# Altium schematic sheet WirelessReceiver.SchDoc
size A2
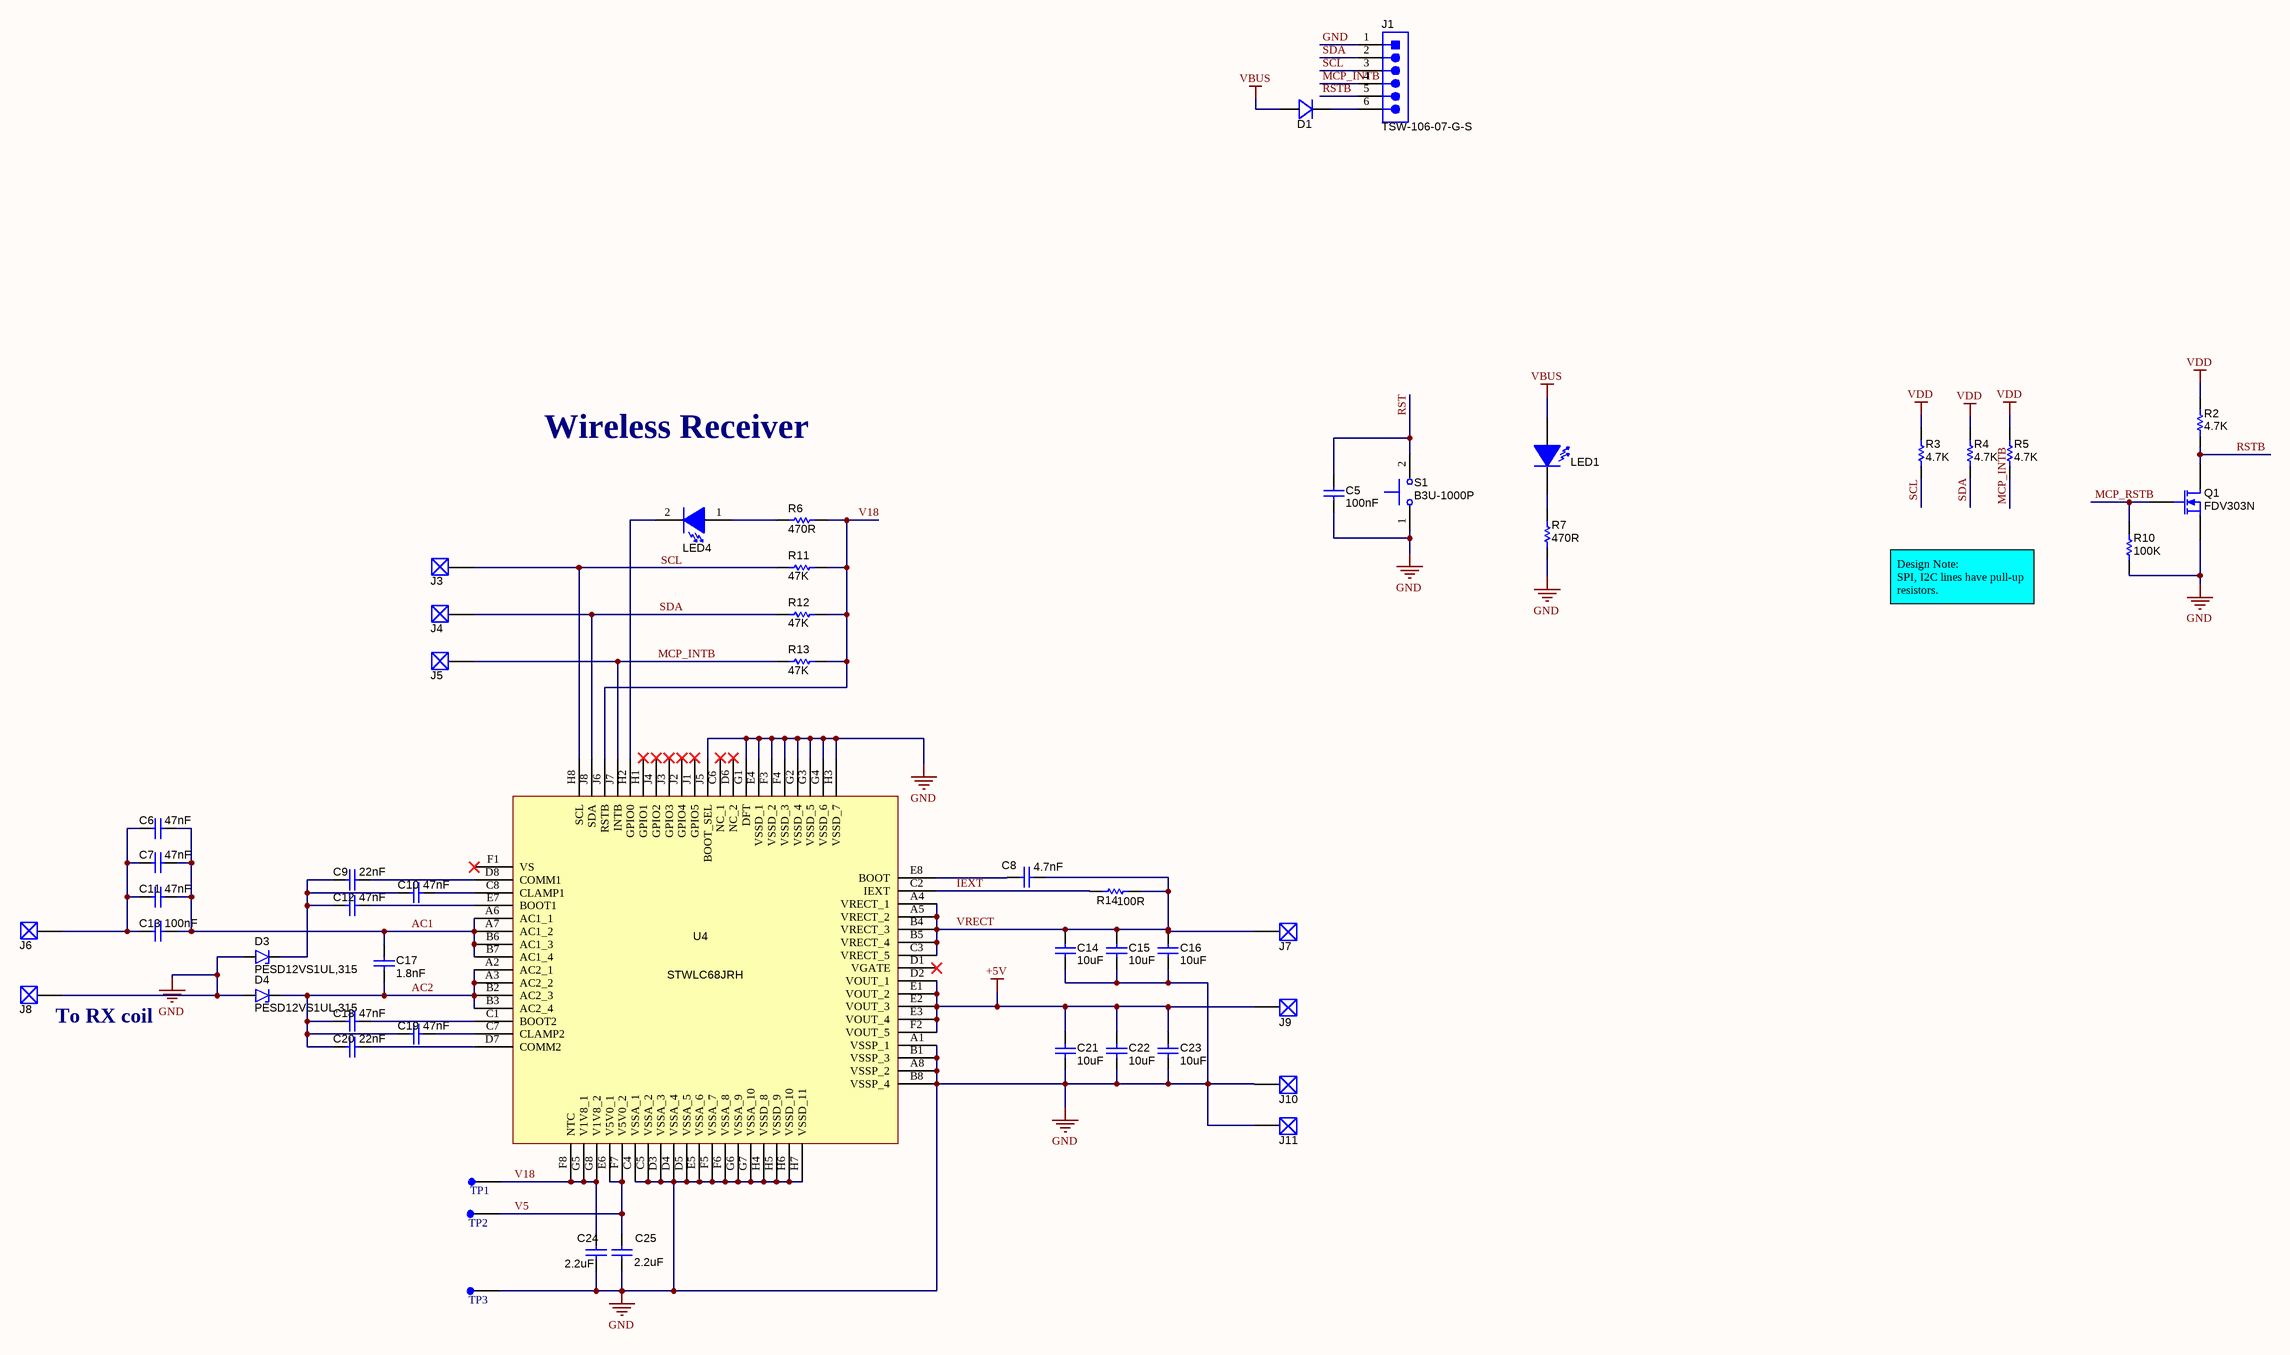
[diagram p0: WirelessReceiver.SchDoc]

## Parts
C5  100nF  [0402]
C6  47nF  [0402]
C7  47nF  [0402]
C8  4.7nF  [0402]
C9  22nF  [0402]
C10  47nF  [0402]
C11  47nF  [0402]
C12  47nF  [0402]
C13  100nF  [0402]
C14  10uF  [0603]
C15  10uF  [0603]
C16  10uF  [0603]
C17  1.8nF  [0402]
C18  47nF  [0402]
C19  47nF  [0402]
C20  22nF  [0402]
C21  10uF  [0603]
C22  10uF  [0603]
C23  10uF  [0603]
C24  2.2uF  [0402]
C25  2.2uF  [0402]
D1  STPS1L60ZFY  [SODFL3718X108N]  (value not drawn)
D3  PESD12VS1UL,315  [SOD882(T)]
D4  PESD12VS1UL,315  [SOD882(T)]
J1  TSW-106-07-G-S  [TSW-106-07-G-S]
J3  1pin PAD  [1PinPad]  (value not drawn)
J4  1pin PAD  [1PinPad]  (value not drawn)
J5  1pin PAD  [1PinPad]  (value not drawn)
J6  1pin PAD  [1PinPad]  (value not drawn)
J7  1pin PAD  [1PinPad]  (value not drawn)
J8  1pin PAD  [1PinPad]  (value not drawn)
J9  1pin PAD  [1PinPad]  (value not drawn)
J10  1pin PAD  [1PinPad]  (value not drawn)
J11  1pin PAD  [1PinPad]  (value not drawn)
LED1  150060VS55040  [WL-SMCW_GREEN]  (value not drawn)
LED4  SML-P12VTT86R  [LED_SMLP12_BLUE]  (value not drawn)
Q1  FDV303N  [SOT23]
R2  4.7K  [0402]
R3  4.7K  [0402]
R4  4.7K  [0402]
R5  4.7K  [0402]
R6  470R
R7  470R
R10  100K  [0402]
R11  47K  [RESC0603X26N]
R12  47K  [RESC0603X26N]
R13  47K  [RESC0603X26N]
R14  100R  [0603]
S1  B3U-1000P  [SW_B3U-1000P]
TP1  TestPoint  [TestPoint]  (value not drawn)
TP2  TestPoint  [TestPoint]  (value not drawn)
TP3  TestPoint  [TestPoint]  (value not drawn)
U4  STWLC68JRH  [BGA72C40P8X9_326X367X57]

## Nets
+5V: C21.1 C22.1 C23.1 J9.1 U4.D2(VOUT_1) U4.E1(VOUT_2) U4.E2(VOUT_3) U4.E3(VOUT_4) U4.F2(VOUT_5)
GND: C5.2 C14.2 C15.2 C16.2 C21.2 C22.2 C23.2 C24.2 C25.2 D3.2(A) D4.2(A) J1.1 J8.1 J10.1 J11.1 Q1.2(S) R7.1 R10.1 S1.1 TP3.1 U4.A1(VSSP_1) U4.A8(VSSP_2) U4.B1(VSSP_3) U4.B8(VSSP_4) U4.C4(VSSA_1) U4.C5(VSSA_2) U4.D3(VSSA_3) U4.D4(VSSA_4) U4.D5(VSSA_5) U4.E4(VSSD_1) U4.E5(VSSA_6) U4.F3(VSSD_2) U4.F4(VSSD_3) U4.F5(VSSA_7) U4.F6(VSSA_8) U4.G1(DFT) U4.G2(VSSD_4) U4.G3(VSSD_5) U4.G4(VSSD_6) U4.G6(VSSA_9) U4.G7(VSSA_10) U4.H3(VSSD_7) U4.H4(VSSD_8) U4.H5(VSSD_9) U4.H6(VSSD_10) U4.H7(VSSD_11) U4.J5(BOOT_SEL)
VBUS: D1.1 LED1.2(A)
VDD: R2.2 R3.2 R4.2 R5.2
AC1: C6.1 C7.1 C11.1 C13.1 C17.1 U4.A6(AC1_1) U4.A7(AC1_2) U4.B6(AC1_3) U4.B7(AC1_4)
AC2: C17.2 C18.2 C19.2 C20.2 D4.1(K) U4.A2(AC2_1) U4.A3(AC2_2) U4.B2(AC2_3) U4.B3(AC2_4)
IEXT: R14.1 U4.C2(IEXT)
MCP_INTB: J1.4 J5.1 R5.1 R13.1 U4.J7(INTB)
MCP_RSTB: Q1.1(G) R10.2
RST: C5.1 S1.2
RSTB: J1.5 Q1.3(D) R2.1
SCL: J1.3 J3.1 R3.1 R11.1 U4.H8(SCL)
SDA: J1.2 J4.1 R4.1 R12.1 U4.J8(SDA)
V5: C25.1 TP2.1 U4.E6(V5V0_1) U4.F7(V5V0_2)
V18: C24.1 R6.2 R11.2 R12.2 R13.2 TP1.1 U4.F8(NTC) U4.G5(V1V8_1) U4.G8(V1V8_2) U4.J6(RSTB)
VRECT: C8.1 C14.1 C15.1 C16.1 J7.1 R14.2 U4.A4(VRECT_1) U4.A5(VRECT_2) U4.B4(VRECT_3) U4.B5(VRECT_4) U4.C3(VRECT_5)
NetC6_2: C6.2 C7.2 C11.2 C13.2 J6.1
NetC8_2: C8.2 U4.E8(BOOT)
NetC9_1: C9.1 U4.D8(COMM1)
NetC9_2: C9.2 C10.2 C12.2 D3.1(K)
NetC10_1: C10.1 U4.C8(CLAMP1)
NetC12_1: C12.1 U4.E7(BOOT1)
NetC18_1: C18.1 U4.C1(BOOT2)
NetC19_1: C19.1 U4.C7(CLAMP2)
NetC20_1: C20.1 U4.D7(COMM2)
NetD1_2: D1.2 J1.6
NetLED1_1: LED1.1(K) R7.2
NetLED4_1: LED4.1(A) R6.1
NetLED4_2: LED4.2(K) U4.H2(GPIO0)

Not connected (* = marked no-connect by the designer): U4 C6(NC_1)* D1(VGATE)* D6(NC_2)* F1(VS)* H1(GPIO1)* J1(GPIO5)* J2(GPIO4)* J3(GPIO3)* J4(GPIO2)*

## Notes on the sheet
- Wireless Receiver
- Design Note:
  SPI, I2C lines have pull-up resistors.
- (near J8) To RX coil

## Library data of the parts
C5 C13 = GCM155R71H104KE02D: 0402 0.1 uF 50 V ±10 % Tolerance X7R Surface Mount Multilayer Ceramic Capacitor; Manufacturer: Murata; Voltage Rating: 50V; Tolerance: 10%; Supplier 1: Digi-Key; Manufacturer Part Number: GCM155R71H104KE02D; Stock 1: 0; Pricing 1: 1=0.1, 10=0.056, 50=0.0304, 100=0.0249, 500=0.0178, 1000=0.014, 2500=0.0127, 5000=0.0117 (USD); Mount: Surface Mount; Case/Package: 0402; Case Code (Metric): 1005; Case Code (Imperial): 0402; Weight: 0.000212oz; Min Operating Temperature: -55°C; Max Operating Temperature: 125°C; Capacitance: 100nF; Packaging: Tape and Reel; Dielectric: X7R; Termination: SMD/SMT; Voltage Rating (DC): 50V; Package Quantity: 10000; Length: 0.039inch; Width: 0.5mm; Height: 0.5mm; Thickness: 0.022inch; Ratings: AEC-Q200; REACH SVHC: No SVHC; Lead Free: Lead Free; RoHS Compliant: Yes; ComponentLink1URL: http://www.farnell.com/datasheets/2079122.pdf?src-supplier=Farnell; ComponentLink1Description: http://www.farnell.com/datasheets/2079122.pdf?src-supplier=Farnell; ComponentLink2URL: http://www.farnell.com/datasheets/2079122.pdf?src-supplier=Element14; ComponentLink2Description: http://www.farnell.com/datasheets/2079122.pdf?src-supplier=Element14; ComponentLink3URL: http://search.murata.co.jp/Ceramy/image/img/A01X/partnumbering_e_02.pdf?src-supplier=Digi-Key; ComponentLink3Description: http://search.murata.co.jp/Ceramy/image/img/A01X/partnumbering_e_02.pdf?src-supplier=Digi-Key; ComponentLink4URL: http://www.mouser.com/ds/2/281/c03e-806517.pdf?src-supplier=Mouser; ComponentLink4Description: http://www.mouser.com/ds/2/281/c03e-806517.pdf?src-supplier=Mouser; ComponentLink5URL: http://www.farnell.com/datasheets/2079122.pdf?src-supplier=Newark; ComponentLink5Description: http://www.farnell.com/datasheets/2079122.pdf?src-supplier=Newark; Supplier Part Number 1: 490-10672-6-ND
C6 C7 C10-C12 C18 C19 = GRM155R71H473KE14D: 0402 0.047 uF 50 V ±10% Tolerance X7R Multilayer Ceramic Capacitor; Manufacturer: Murata; Voltage Rating (DC): 50V; Supplier 1: Digi-Key; Manufacturer Part Number: GRM155R71H473KE14D; Stock 1: 1080064; Pricing 1: 1=0.1, 10=0.029, 50=0.0158, 100=0.0129, 500=0.0092, 1000=0.0073, 2500=0.0066, 5000=0.0061 (USD); Mount: Surface Mount; Case/Package: 0402; Case Code (Metric): 1005; Case Code (Imperial): 0402; Weight: 0.000212oz; Min Operating Temperature: -55°C; Max Operating Temperature: 125°C; Capacitance: 47nF; Tolerance: 10%; Dielectric: X7R; Packaging: Tape and Reel; Voltage Rating: 50V; Termination: SMD/SMT; Resistor Type: Ceramic; Package Quantity: 10000; Length: 0.039inch; Width: 0.02inch; Height: 0.5mm; Thickness: 0.022inch; ComponentLink1URL: http://search.murata.co.jp/Ceramy/image/img/A01X/G101/ENG/GRM155R71H473KE14-01.pdf?src-supplier=Digi-Key; ComponentLink1Description: http://search.murata.co.jp/Ceramy/image/img/A01X/G101/ENG/GRM155R71H473KE14-01.pdf?src-supplier=Digi-Key; ComponentLink2URL: http://www.mouser.com/ds/2/281/c02e-2905.pdf?src-supplier=Mouser; ComponentLink2Description: http://www.mouser.com/ds/2/281/c02e-2905.pdf?src-supplier=Mouser; Supplier Part Number 1: 490-10702-6-ND
C8 = GCM155R71H472KA37D: CAP CER 4700PF 50V X7R 0402; Manufacturer: Murata; Tolerance: 10%; Dissipation Factor: 0.01%; Supplier 1: Digi-Key; Manufacturer Part Number: GCM155R71H472KA37D; Stock 1: 206906; Pricing 1: 1=0.1, 10=0.041, 50=0.0226, 100=0.0184, 500=0.0131, 1000=0.0103, 2500=0.0094, 5000=0.0086 (USD); Mount: Surface Mount; Case/Package: 0402; Case Code (Imperial): 0402; Case Code (Metric): 1005; Min Operating Temperature: -55°C; Max Operating Temperature: 125°C; Capacitance: 4.7nF; Dielectric: X7R; Packaging: Tape and Reel; Voltage Rating: 50V; Voltage Rating (DC): 50V; Package Quantity: 1; Termination: SMD/SMT; Voltage: 50V; Series: GCM; Construction: Flat; Length: 1mm; Width: 0.5mm; Height: 0.5mm; Thickness: 0.022inch; Depth: 0.5mm; Ratings: AEC-Q200; Radiation Hardening: No; Lead Free: Lead Free; RoHS Compliant: Yes; ComponentLink1URL: https://search.murata.co.jp/Ceramy/image/img/A01X/G101/ENG/GCM155R71H472KA37-01.pdf?src-supplier=Digi-Key; ComponentLink1Description: https://search.murata.co.jp/Ceramy/image/img/A01X/G101/ENG/GCM155R71H472KA37-01.pdf?src-supplier=Digi-Key; ComponentLink2URL: http://psearch.murata.com/capacitor/product/GCM155R71H472KA37%23.pdf?src-supplier=Avnet; ComponentLink2Description: http://psearch.murata.com/capacitor/product/GCM155R71H472KA37%23.pdf?src-supplier=Avnet; ComponentLink3URL: http://psearch.murata.com/capacitor/product/GCM155R71H472KA37%23.pdf?src-supplier=Future+Electronics; ComponentLink3Description: http://psearch.murata.com/capacitor/product/GCM155R71H472KA37%23.pdf?src-supplier=Future+Electronics; ComponentLink4URL: http://psearch.murata.com/capacitor/product/GCM155R71H472KA37%23.pdf?src-supplier=Avnet+Europe; ComponentLink4Description: http://psearch.murata.com/capacitor/product/GCM155R71H472KA37%23.pdf?src-supplier=Avnet+Europe; ComponentLink5URL: https://www.verical.com/server-webapp/html/getDatasheet?partID=724237&src-supplier=Verical; ComponentLink5Description: https://www.verical.com/server-webapp/html/getDatasheet?partID=724237&src-supplier=Verical; Supplier Part Number 1: 490-4915-6-ND
C9 C20 = GRM155R71H223KA12D: MURATA - GRM155R71H223KA12D - SMD Multilayer Ceramic Capacitor, 22000 pF, 50 V, 0402 [1005 Metric], ± 10%, X7R, GRM Series - SMD Multilayer Ceramic Capacitor, 22000 pF, 50 V, 0402 [1005 Metric], ± 10%, X7R, GRM Series; Voltage Rating: 50V; Supplier 1: Digi-Key; Manufacturer: Murata; Manufacturer Part Number: GRM155R71H223KA12D; Stock 1: 589; Pricing 1: 1=0.1, 10=0.042, 50=0.0232, 100=0.0189, 500=0.0135, 1000=0.0106, 2500=0.0096, 5000=0.0089 (USD); Mount: Surface Mount; Case/Package: 0402; Number of Pins: 2; Case Code (Metric): 1005; Case Code (Imperial): 0402; Material: Ceramic; Min Operating Temperature: -55°C; Max Operating Temperature: 125°C; Capacitance: 22nF; Tolerance: 10%; Dielectric: X7R; Packaging: Tape and Reel; Package Quantity: 1; Voltage Rating (DC): 50V; Termination: SMD/SMT; Voltage: 50V; Series: GRM; Construction: Flat; Length: 1mm; Width: 0.02inch; Height: 0.5mm; Thickness: 0.022inch; Depth: 0.5mm; Radiation Hardening: No; REACH SVHC: No SVHC; Lead Free: Lead Free; RoHS Compliant: Yes; ComponentLink1URL: http://www.farnell.com/datasheets/2048677.pdf?src-supplier=Element14; ComponentLink1Description: http://www.farnell.com/datasheets/2048677.pdf?src-supplier=Element14; ComponentLink2URL: https://www.murata.com/~/media/webrenewal/support/library/catalog/products/capacitor/mlcc/c02e.ashx?la=en-us&src-supplier=Digi-Key; ComponentLink2Description: https://www.murata.com/~/media/webrenewal/support/library/catalog/products/capacitor/mlcc/c02e.ashx?la=en-us&src-supplier=Digi-Key; ComponentLink3URL: http://search.murata.co.jp/Ceramy/image/img/w_hinm/L0005E.pdf?src-supplier=Future+Electronics; ComponentLink3Description: http://search.murata.co.jp/Ceramy/image/img/w_hinm/L0005E.pdf?src-supplier=Future+Electronics; ComponentLink4URL: https://www.verical.com/server-webapp/html/getDatasheet?partID=178940&src-supplier=Verical; ComponentLink4Description: https://www.verical.com/server-webapp/html/getDatasheet?partID=178940&src-supplier=Verical; ComponentLink5URL: https://produktinfo.conrad.com/datenblaetter/450000-474999/454297-da-01-en-VS_KONDENSATOR_0402.pdf?src-supplier=Conrad; ComponentLink5Description: https://produktinfo.conrad.com/datenblaetter/450000-474999/454297-da-01-en-VS_KONDENSATOR_0402.pdf?src-supplier=Conrad; Supplier Part Number 1: 490-3884-1-ND
C14-C16 C21-C23 = GRM188R61E106MA73D: CAP CER 10UF 25V X5R 0603; Manufacturer: Murata; Tolerance: 20%; Supplier 1: Digi-Key; Manufacturer Part Number: GRM188R61E106MA73D; Stock 1: 809282; Pricing 1: 1=0.37, 10=0.257, 50=0.1712, 100=0.1455, 500=0.1027, 1000=0.0899 (USD); Mount: Surface Mount; Case/Package: 0603; Number of Pins: 2; Case Code (Metric): 1608; Case Code (Imperial): 0603; Weight: 0.000222oz; Min Operating Temperature: -55°C; Max Operating Temperature: 85°C; Voltage Rating: 25V; Capacitance: 10uF; Packaging: Tape and Reel; Package Quantity: 1; Dielectric: X5R; Voltage: 25V; Termination: SMD/SMT; Resistor Type: Ceramic; Voltage Rating (DC): 25V; Series: GRM; Construction: Flat; Length: 1.6mm; Width: 0.031inch; Height: 0.8mm; Thickness: 0.031inch; Depth: 0.8mm; REACH SVHC: No SVHC; Lead Free: Lead Free; RoHS Compliant: Yes; ComponentLink1URL: http://www.murata.com/products/catalog/pdf/c02e.pdf?src-supplier=Farnell; ComponentLink1Description: http://www.murata.com/products/catalog/pdf/c02e.pdf?src-supplier=Farnell; ComponentLink2URL: http://www.murata.com/products/catalog/pdf/c02e.pdf?src-supplier=Element14; ComponentLink2Description: http://www.murata.com/products/catalog/pdf/c02e.pdf?src-supplier=Element14; ComponentLink3URL: http://www.farnell.com/datasheets/608985.pdf?src-supplier=Farnell; ComponentLink3Description: http://www.farnell.com/datasheets/608985.pdf?src-supplier=Farnell; ComponentLink4URL: https://www.murata.com/~/media/webrenewal/support/library/catalog/products/capacitor/mlcc/c02e.ashx?la=en-us&src-supplier=Digi-Key; ComponentLink4Description: https://www.murata.com/~/media/webrenewal/support/library/catalog/products/capacitor/mlcc/c02e.ashx?la=en-us&src-supplier=Digi-Key; Supplier Part Number 1: 490-7202-6-ND
C17 = GRM155R71H182JA01D: Multilayer Ceramic Capacitors MLCC - SMD/SMT 1800PF 50V 5%; Manufacturer: Murata; Dielectric: X7R; Supplier 1: Digi-Key; Manufacturer Part Number: GRM155R71H182JA01D; Stock 1: 146126; Pricing 1: 1=0.1, 10=0.031, 50=0.0172, 100=0.014, 500=0.01, 1000=0.0079, 2500=0.0072, 5000=0.0066 (USD); Mount: Surface Mount; Case/Package: 0402; Case Code (Imperial): 0402; Case Code (Metric): 1005; Min Operating Temperature: -55°C; Max Operating Temperature: 125°C; Tolerance: 5%; Packaging: Tape and Reel; Capacitance: 1.8nF; Voltage Rating: 50V; Voltage Rating (DC): 50V; Package Quantity: 10000; Termination: SMD/SMT; Series: GRM; Construction: Flat; Length: 1mm; Width: 0.02inch; Height: 0.5mm; Thickness: 0.022inch; Depth: 0.5mm; Radiation Hardening: No; Lead Free: Lead Free; RoHS Compliant: Yes; ComponentLink1URL: http://www.mouser.com/ds/2/281/c02e-2905.pdf?src-supplier=Mouser; ComponentLink1Description: http://www.mouser.com/ds/2/281/c02e-2905.pdf?src-supplier=Mouser; ComponentLink2URL: http://www.murata.com/products/catalog/pdf/c02e.pdf?src-supplier=Avnet; ComponentLink2Description: http://www.murata.com/products/catalog/pdf/c02e.pdf?src-supplier=Avnet; Supplier Part Number 1: 490-12535-6-ND
C24 C25 = GRM155R61E225KE11D: Cap Ceramic 2.2uF 25V X5R 10% Pad SMD 0402 85°C T/R; Manufacturer: Murata; Supplier 1: Digi-Key; Manufacturer Part Number: GRM155R61E225KE11D; Stock 1: 0; Pricing 1: 1=0.28, 10=0.19, 50=0.1138, 100=0.0961, 500=0.0658, 1000=0.0582, 2500=0.0557, 5000=0.0506 (USD); Mount: Surface Mount; Case/Package: 0402; Case Code (Metric): 1005; Material: Ceramic; Case Code (Imperial): 0402; Weight: 0.000212oz; Min Operating Temperature: -55°C; Max Operating Temperature: 85°C; Tolerance: 10%; Dielectric: X5R; Capacitance: 2.2uF; Packaging: Tape and Reel; Voltage Rating: 25V; Termination: SMD/SMT; Resistor Type: Ceramic; Voltage Rating (DC): 25V; Package Quantity: 10000; Length: 1mm; Width: 0.5mm; Height: 0.5mm; Thickness: 0.022inch; Lead Free: Lead Free; ComponentLink1URL: http://search.murata.co.jp/Ceramy/image/img/A01X/G101/ENG/GRM155R61E225KE11-01.pdf?src-supplier=Digi-Key; ComponentLink1Description: http://search.murata.co.jp/Ceramy/image/img/A01X/G101/ENG/GRM155R61E225KE11-01.pdf?src-supplier=Digi-Key; ComponentLink2URL: http://search.murata.co.jp/Ceramy/image/img/A01X/partnumbering_e_01.pdf?src-supplier=Digi-Key; ComponentLink2Description: http://search.murata.co.jp/Ceramy/image/img/A01X/partnumbering_e_01.pdf?src-supplier=Digi-Key; ComponentLink3URL: http://www.mouser.com/ds/2/281/c02e-2905.pdf?src-supplier=Mouser; ComponentLink3Description: http://www.mouser.com/ds/2/281/c02e-2905.pdf?src-supplier=Mouser; ComponentLink4URL: http://psearch.en.murata.com/capacitor/product/GRM155R61E225KE11%23.pdf?src-supplier=Avnet; ComponentLink4Description: http://psearch.en.murata.com/capacitor/product/GRM155R61E225KE11%23.pdf?src-supplier=Avnet; Supplier Part Number 1: 490-12703-6-ND
D1 = STPS1L60ZFY: STMICROELECTRONICS - STPS1L60ZFY - SCHOTTKY RECTIFIER, 1A, 60V, SOD-123FL; Supplier 1: Digi-Key; Manufacturer: STMicroelectronics; Manufacturer Part Number: STPS1L60ZFY; Stock 1: 32940; Pricing 1: 1=0.48, 10=0.335, 100=0.1692, 500=0.138, 1000=0.1024 (USD); Mount: Surface Mount; Case/Package: SOD; Packaging: Tape and Reel; Max Reverse Voltage (DC): 60V; Average Rectified Current: 1A; RoHS Compliant: Yes; ComponentLink1URL: http://www.farnell.com/datasheets/2236220.pdf?src-supplier=Newark; ComponentLink1Description: http://www.farnell.com/datasheets/2236220.pdf?src-supplier=Newark; ComponentLink2URL: http://www.farnell.com/datasheets/2236220.pdf?src-supplier=Farnell; ComponentLink2Description: http://www.farnell.com/datasheets/2236220.pdf?src-supplier=Farnell; ComponentLink3URL: http://www.farnell.com/datasheets/2236220.pdf?src-supplier=Element14; ComponentLink3Description: http://www.farnell.com/datasheets/2236220.pdf?src-supplier=Element14; ComponentLink4URL: http://www.st.com/content/ccc/resource/technical/document/datasheet/group3/30/c9/5d/e4/a8/dc/4a/b5/DM00303324/files/DM00303324.pdf/jcr:content/translations/en.DM00303324.pdf?src-supplier=Digi-Key; ComponentLink4Description: http://www.st.com/content/ccc/resource/technical/document/datasheet/group3/30/c9/5d/e4/a8/dc/4a/b5/DM00303324/files/DM00303324.pdf/jcr:content/translations/en.DM00303324.pdf?src-supplier=Digi-Key; Supplier Part Number 1: 497-17154-6-ND
D3 D4 = PESD12VS1UL,315: TVS DIODE 12V 35V SOD882; Manufacturer: Nexperia; Supplier 1: Digi-Key; Manufacturer Part Number: PESD12VS1UL,315; Stock 1: 37205; Pricing 1: 1=0.43, 10=0.303, 100=0.1531, 500=0.1249, 1000=0.0926, 2000=0.0779, 5000=0.0745 (USD); RoHS Compliant: Yes; Supplier Part Number 1: 1727-4184-6-ND
J1 = TSW-106-07-G-S: Header, 100mil, 6x1, Gold, TH; Manufacturer: Samtec; SymbolCreator: a0412235; U/M: EA; SymbolVersion: 2013-08-30; PartNumber: TSW-106-07-G-S; PackageReference: 6x1 Header; ClassName: Header; CompType: Header; RoHS: Y; MountType: TH; ComponentLink1Description: Datasheet Link; ComponentLink1URL: http://samtec.com/ftppub/pdf/TSW_TH.PDF; Publisher: Texas Instruments; LatestRevisionDate: 2015-08-25; Supplier 1: Digi-Key; Supplier Part Number 1: SAM1029-06-ND
LED1 = 150060VS55040: LED GREEN DIFFUSED 0603 SMD; Manufacturer: Wurth Electronics; Lens Style: Flat; Luminous Intensity: 60mcd; Forward Voltage: 2V; Test Current: 20mA; Viewing Angle: 140°; Dominant Wavelength: 573nm; Lens Size: 0.8mm; Supplier 1: Digi-Key; Manufacturer Part Number: 150060VS55040; Stock 1: 25176; Pricing 1: 1=0.18, 10=0.162, 100=0.147, 500=0.132, 1000=0.117 (USD); Mount: Surface Mount; Case/Package: 0603; Color: Green; Case Code (Imperial): 0603; Case Code (Metric): 1608; Packaging: Cut Tape; Lens Transparency: Diffused; Length: 1.6mm; Width: 0.8mm; Height: 0.5mm; RoHS Compliant: No; ComponentLink1URL: http://www.farnell.com/datasheets/2621647.pdf?src-supplier=Farnell; ComponentLink1Description: http://www.farnell.com/datasheets/2621647.pdf?src-supplier=Farnell; ComponentLink2URL: http://www.farnell.com/datasheets/2621647.pdf?src-supplier=Element14; ComponentLink2Description: http://www.farnell.com/datasheets/2621647.pdf?src-supplier=Element14; ComponentLink3URL: http://www.farnell.com/datasheets/2621647.pdf?src-supplier=Newark; ComponentLink3Description: http://www.farnell.com/datasheets/2621647.pdf?src-supplier=Newark; ComponentLink4URL: https://www.we-online.de/web/en/index.php/download/media/07_electronic_components/download_center_1/application_notes_berichte/ano002_leds___the_future_of_horticultural_lighting/ANO002b_EN_LEDs_The_Future_of_Horticultural_Lighting.pdf?src-supplier=Digi-Key; ComponentLink4Description: https://www.we-online.de/web/en/index.php/download/media/07_electronic_components/download_center_1/application_notes_berichte/ano002_leds___the_future_of_horticultural_lighting/ANO002b_EN_LEDs_The_Future_of_Horticultural_Lighting.pdf?src-supplier=Digi-Key; ComponentLink5URL: https://katalog.we-online.de/pbs/datasheet/150060VS55040.pdf?src-supplier=Digi-Key; ComponentLink5Description: https://katalog.we-online.de/pbs/datasheet/150060VS55040.pdf?src-supplier=Digi-Key; Supplier Part Number 1: 732-12017-6-ND
LED4 = SML-P12VTT86R: ROHM - SML-P12VTT86R - LED, PICOLED, Red, SMD, 1005, 20 mA, 2 V, 630 nm; Lens Color: Colorless; Lens Style: Diffused,Colorless,Square; Lens Transparency: Clear; Luminous Intensity: 60mcd; Test Current: 20mA; Dominant Wavelength: 630nm; Forward Voltage: 2V; Number of LEDs: 1; Supplier 1: Digi-Key; Manufacturer: Rohm; Manufacturer Part Number: SML-P12VTT86R; Stock 1: 0; Pricing 1: 1=0.41, 10=0.322, 100=0.1446, 500=0.1306, 1000=0.1073, 2000=0.0933 (USD); Mount: Surface Mount; Case/Package: 0402; Number of Pins: 2; Color: Red; Case Code (Metric): 1006; Case Code (Imperial): 0402; Packaging: Cut Tape; Forward Current: 20mA; Wavelength: 630nm; Length: 1mm; Width: 0.6mm; Height: 0.25mm; REACH SVHC: Unknown; Lead Free: Lead Free; RoHS Compliant: Yes; Supplier Part Number 1: 846-1168-1-ND
Q1 = FDV303N: Trans Mosfet N-ch 25V 0.68A 3-PIN SOT-23 T/r; Manufacturer: ON Semiconductor / Fairchild; Rise Time: 8.5ns; Continuous Drain Current (ID): 680mA; Gate to Source Voltage (Vgs): 8V; Drain to Source Resistance: 450mR; Power Dissipation: 350mW; Turn-Off Delay Time: 17ns; Element Configuration: Single; Input Capacitance: 50pF; Turn-On Delay Time: 3ns; Nominal Vgs: 800mV; Number of Elements: 1; Current: 12A; Voltage: 20V; Supplier 1: Digi-Key; Manufacturer Part Number: FDV303N; Stock 1: 160024; Pricing 1: 1=0.4, 10=0.273, 25=0.2572, 100=0.1331, 500=0.111, 1000=0.0771 (USD); Mount: Surface Mount; Case/Package: SOT-23; Number of Pins: 3; Contact Plating: Tin,Matte; Min Operating Temperature: -55°C; Max Operating Temperature: 150°C; Packaging: Tape and Reel; Drain to Source Breakdown Voltage: 25V; Fall Time: 8.5ns; Package Quantity: 1; Rds On Max: 450mR; Max Power Dissipation: 350mW; Drain to Source Voltage (Vdss): 25V; Dual Supply Voltage: 25V; Threshold Voltage: 800mV; Voltage Rating (DC): 25V; Current Rating: 680mA; On-State Resistance: 450mR; Termination: SMD/SMT; Length: 2.92mm; Width: 3.05mm; Height: 0.93mm; Radiation Hardening: No; RoHS Compliant: Yes; REACH SVHC: No SVHC; Lead Free: Lead Free; ComponentLink1URL: http://www.fairchildsemi.com/ds/FD/FDV303N.pdf?src-supplier=Farnell; ComponentLink1Description: http://www.fairchildsemi.com/ds/FD/FDV303N.pdf?src-supplier=Farnell; ComponentLink2URL: http://www.farnell.com/datasheets/2304020.pdf?src-supplier=Distrelec; ComponentLink2Description: http://www.farnell.com/datasheets/2304020.pdf?src-supplier=Distrelec; ComponentLink3URL: http://www.farnell.com/datasheets/2304020.pdf?src-supplier=Mouser; ComponentLink3Description: http://www.farnell.com/datasheets/2304020.pdf?src-supplier=Mouser; ComponentLink4URL: http://www.jameco.com/Jameco/Products/ProdDS/871092.pdf?src-supplier=Jameco; ComponentLink4Description: http://www.jameco.com/Jameco/Products/ProdDS/871092.pdf?src-supplier=Jameco; ComponentLink5URL: http://www.farnell.com/datasheets/2304020.pdf?src-supplier=Element14; ComponentLink5Description: http://www.farnell.com/datasheets/2304020.pdf?src-supplier=Element14; ComponentLink6URL: http://www.farnell.com/datasheets/2304020.pdf?src-supplier=Avnet; ComponentLink6Description: http://www.farnell.com/datasheets/2304020.pdf?src-supplier=Avnet; ComponentLink7URL: http://www.fairchildsemi.com/ds/FD/FDV303N.pdf?src-supplier=Future+Electronics; ComponentLink7Description: http://www.fairchildsemi.com/ds/FD/FDV303N.pdf?src-supplier=Future+Electronics; ComponentLink8URL: https://www.verical.com/server-webapp/html/getDatasheet?partID=90649&src-supplier=Verical; ComponentLink8Description: https://www.verical.com/server-webapp/html/getDatasheet?partID=90649&src-supplier=Verical; ComponentLink9URL: https://www.fairchildsemi.com/package-drawings/MA/MA03B.pdf?src-supplier=Digi-Key; ComponentLink9Description: https://www.fairchildsemi.com/package-drawings/MA/MA03B.pdf?src-supplier=Digi-Key; ComponentLink10URL: https://media.digikey.com/pdf/Data%20Sheets/Fairchild%20PDFs/FDV303N.pdf?src-supplier=Digi-Key; ComponentLink10Description: https://media.digikey.com/pdf/Data%20Sheets/Fairchild%20PDFs/FDV303N.pdf?src-supplier=Digi-Key; Supplier Part Number 1: FDV303NDKR-ND
R2-R5 = MCS04020C4701FE000: VISHAY - MCS04020C4701FE000 - RES, THIN FILM, 4.7K, 1%, 50V, 0402; Manufacturer: Vishay Beyschlag; Resistance: 4.7kR; Temperature Coefficient: 50ppm/°C; Power Rating: 100mW; Supplier 1: Digi-Key; Manufacturer Part Number: MCS04020C4701FE000; Stock 1: 25238; Pricing 1: 1=0.14, 10=0.12, 100=0.0468, 1000=0.0196, 2500=0.018, 5000=0.0163 (USD); Case/Package: 0402; Contact Plating: Tin; Case Code (Metric): 1005; Case Code (Imperial): 0402; Min Operating Temperature: -55°C; Max Operating Temperature: 125°C; Tolerance: 1%; Resistor Type: Thin Film; Package Quantity: 1; Packaging: Tape and Reel; Number of Terminations: 2; Voltage Rating: 50V; Max Power Dissipation: 100mW; Voltage Rating (DC): 50V; Series: MCS 0402 - Professional; Construction: Rectangular; Resistance Tolerance: 1%; Length: 0.039inch; Width: 0.02inch; Height: 0.015inch; Depth: 0.5mm; Radiation Hardening: No; Military Standard: Not; REACH SVHC: No SVHC; Lead Free: Lead Free; RoHS Compliant: Yes; ComponentLink1URL: http://www.vishay.com/docs/28705/mcx0x0xpro.pdf?src-supplier=Digi-Key; ComponentLink1Description: http://www.vishay.com/docs/28705/mcx0x0xpro.pdf?src-supplier=Digi-Key; ComponentLink2URL: http://www.vishay.com/docs/28705/mc_pro.pdf?src-supplier=Avnet+Europe; ComponentLink2Description: http://www.vishay.com/docs/28705/mc_pro.pdf?src-supplier=Avnet+Europe; Supplier Part Number 1: MCS0402-4.70K-CFDKR-ND
R6 R7 = CR0201-JW-471GLF: Res Thick Film 0201 470 Ohm 5% 1/20W ±200ppm/°C Molded SMD Paper T/R; Manufacturer: Bourns; Max Power Dissipation: 50mW; Temperature Coefficient: 250ppm/°C; Supplier 1: Mouser; Manufacturer Part Number: CR0201-JW-471GLF; Stock 1: 8749; Pricing 1: 1=0.23, 10=0.1, 50=0.1, 100=0.057, 1000=0.031, 10000=0.002 (USD); Case/Package: 0201; Min Operating Temperature: -55°C; Max Operating Temperature: 125°C; Package Quantity: 10000; Packaging: Tape and Reel; Resistance: 470R; Tolerance: 5%; Resistor Type: Thick Film; Number of Terminations: 2; Length: 0.024inch; Width: 0.012inch; Height: 0.01inch; RoHS Compliant: Yes; ComponentLink1URL: http://www.bourns.com/docs/Product-Datasheets/CR0201.pdf?src-supplier=Digi-Key; ComponentLink1Description: http://www.bourns.com/docs/Product-Datasheets/CR0201.pdf?src-supplier=Digi-Key; Supplier Part Number 1: 652-CR0201-JW-471GLF
R10 = TNPW0402100KBEED: VISHAY - TNPW0402100KBEED - RES, THIN FILM, 100K, 0.1%, 0.063W, 0402; Manufacturer: Vishay Dale; Resistance: 100kR; Power Rating: 63mW; Voltage Rating: 50V; Temperature Coefficient: 25ppm/°C; Max Power Dissipation: 100mW; Supplier 1: Digi-Key; Manufacturer Part Number: TNPW0402100KBEED; Stock 1: 417; Pricing 1: 1=0.56, 10=0.4, 100=0.208, 1000=0.112, 2500=0.1088 (USD); Case/Package: 0402; Case Code (Imperial): 0402; Case Code (Metric): 1005; Weight: 2.3E-05oz; Contact Plating: Tin; Size Code: 0402; Min Operating Temperature: -55°C; Max Operating Temperature: 125°C; Packaging: Tape and Reel; Termination: SMD/SMT; Resistor Type: Thin Film; Voltage Rating (DC): 50V; Features: Moisture Resistant,Automotive AEC-Q200,Anti-Sulfur; Series: TNPW e3; Number of Terminations: 2; Construction: Rectangular; Resistance Tolerance: 0.1%; Length: 1mm; Width: 0.5mm; Height: 0.35mm; Depth: 0.5mm; Radiation Hardening: No; REACH SVHC: Unknown; Military Standard: Not; Lead Free: Lead Free; RoHS Compliant: Yes; ComponentLink1URL: http://www.farnell.com/datasheets/2049119.pdf?src-supplier=Element14; ComponentLink1Description: http://www.farnell.com/datasheets/2049119.pdf?src-supplier=Element14; ComponentLink2URL: http://www.vishay.com/docs/28758/tnpw_e3.pdf?src-supplier=Avnet; ComponentLink2Description: http://www.vishay.com/docs/28758/tnpw_e3.pdf?src-supplier=Avnet; Supplier Part Number 1: TNP100KDADKR-ND
R11-R13 = CR0201-JW-474GLF: Res Thick Film 0201 470K Ohm 5% 1/20W ±200ppm/°C Molded SMD Paper T/R; Manufacturer: Bourns; Resistance: 470kR; Max Power Dissipation: 50mW; Temperature Coefficient: 250ppm/°C; Supplier 1: Digi-Key; Manufacturer Part Number: CR0201-JW-474GLF; Stock 1: 0; Pricing 1: 10000=0.0024 (USD); Case/Package: 0201; Min Operating Temperature: -55°C; Max Operating Temperature: 125°C; Package Quantity: 10000; Packaging: Tape and Reel; Tolerance: 5%; Resistor Type: Thick Film; Number of Terminations: 2; Length: 0.024inch; Width: 0.012inch; Height: 0.01inch; RoHS Compliant: Yes; ComponentLink1URL: http://www.bourns.com/docs/Product-Datasheets/CR0201.pdf?src-supplier=Digi-Key; ComponentLink1Description: http://www.bourns.com/docs/Product-Datasheets/CR0201.pdf?src-supplier=Digi-Key; Supplier Part Number 1: CR0201-JW-474GLF-ND
R14 = CRGP0603F100R: TE CONNECTIVITY - CRGP0603F100R - RES, 100R, 1%, 0.25W, 0603, THICK FILM; Max Power Dissipation: 250mW; Temperature Coefficient: 200ppm/°C; Supplier 1: Digi-Key; Manufacturer: TE Connectivity; Manufacturer Part Number: CRGP0603F100R; Stock 1: 13412; Pricing 1: 1=0.15, 10=0.126, 100=0.0491, 1000=0.0206, 2500=0.0189 (USD); Case/Package: 0603; Min Operating Temperature: -55°C; Max Operating Temperature: 155°C; Resistor Type: Thick Film; Packaging: Cut Tape; Resistance: 100R; Tolerance: 1%; Number of Terminations: 2; RoHS Compliant: Yes; ComponentLink1URL: https://4donline.ihs.com/images/VipMasterIC/IC/TYEL/TYEL-S-A0005460475/TYEL-S-A0005460475-1.pdf?hkey=52A5661711E402568146F3353EA87419&src-supplier=Farnell; ComponentLink1Description: https://4donline.ihs.com/images/VipMasterIC/IC/TYEL/TYEL-S-A0005460475/TYEL-S-A0005460475-1.pdf?hkey=52A5661711E402568146F3353EA87419&src-supplier=Farnell; ComponentLink2URL: https://4donline.ihs.com/images/VipMasterIC/IC/TYEL/TYEL-S-A0005460475/TYEL-S-A0005460475-1.pdf?hkey=52A5661711E402568146F3353EA87419&src-supplier=Newark; ComponentLink2Description: https://4donline.ihs.com/images/VipMasterIC/IC/TYEL/TYEL-S-A0005460475/TYEL-S-A0005460475-1.pdf?hkey=52A5661711E402568146F3353EA87419&src-supplier=Newark; ComponentLink3URL: https://www.te.com/commerce/DocumentDelivery/DDEController?Action=srchrtrv&DocNm=9-1773463-9&DocType=DS&DocLang=English&src-supplier=Digi-Key; ComponentLink3Description: https://www.te.com/commerce/DocumentDelivery/DDEController?Action=srchrtrv&DocNm=9-1773463-9&DocType=DS&DocLang=English&src-supplier=Digi-Key; Supplier Part Number 1: A130404DKR-ND
S1 = B3U-1000P: SWITCH TACTILE SPST-NO 0.05A 12V; Manufacturer: Omron Electronic Components; SymbolCreator: a0412235; VDC_V: 12; SwitchFunction: Off-Mom; PositionCount: 1; CurrentRating_mA: 50; SymbolVersion: 2012-10-29; PartNumber: B3U-1000P; MountType: SMT; ComponentLink1Description: Datasheet URL; ComponentLink1URL: http://www.components.omron.com/components/web/PDFLIB.nsf/0/2DD3893C7DD33E9E862572900079E9D6/$file/B3U_1110.pdf; RoHS: Y; Circuit: SPST-NO; Orientation: Top Actuated; CompType: Switch; PackageReference: 3x1.6x2.5mm; Publisher: Texas Instruments; LatestRevisionDate: 2015-08-27; Supplier 1: Digi-Key; Supplier Part Number 1: SW1020CT-ND; Supplier 2: Mouser; Supplier Part Number 2: 653-B3U-1000P; Supplier 3: Farnell; Supplier Part Number 3: 1333652
U4 = STWLC68JRH: Wireless receiver IC; Manufacturer: STMicroelectronics; Supplier 1: Digi-Key; Manufacturer Part Number: STWLC68JRH; Stock 1: 2515; Pricing 1: 1=6.18, 10=5.55, 25=5.2468, 100=4.314, 250=3.871, 500=3.8498 (USD); Supplier Part Number 1: 497-STWLC68JRHDKR-ND